# Altium schematic sheet 新风驱动板Nedic.SchDoc
size A2
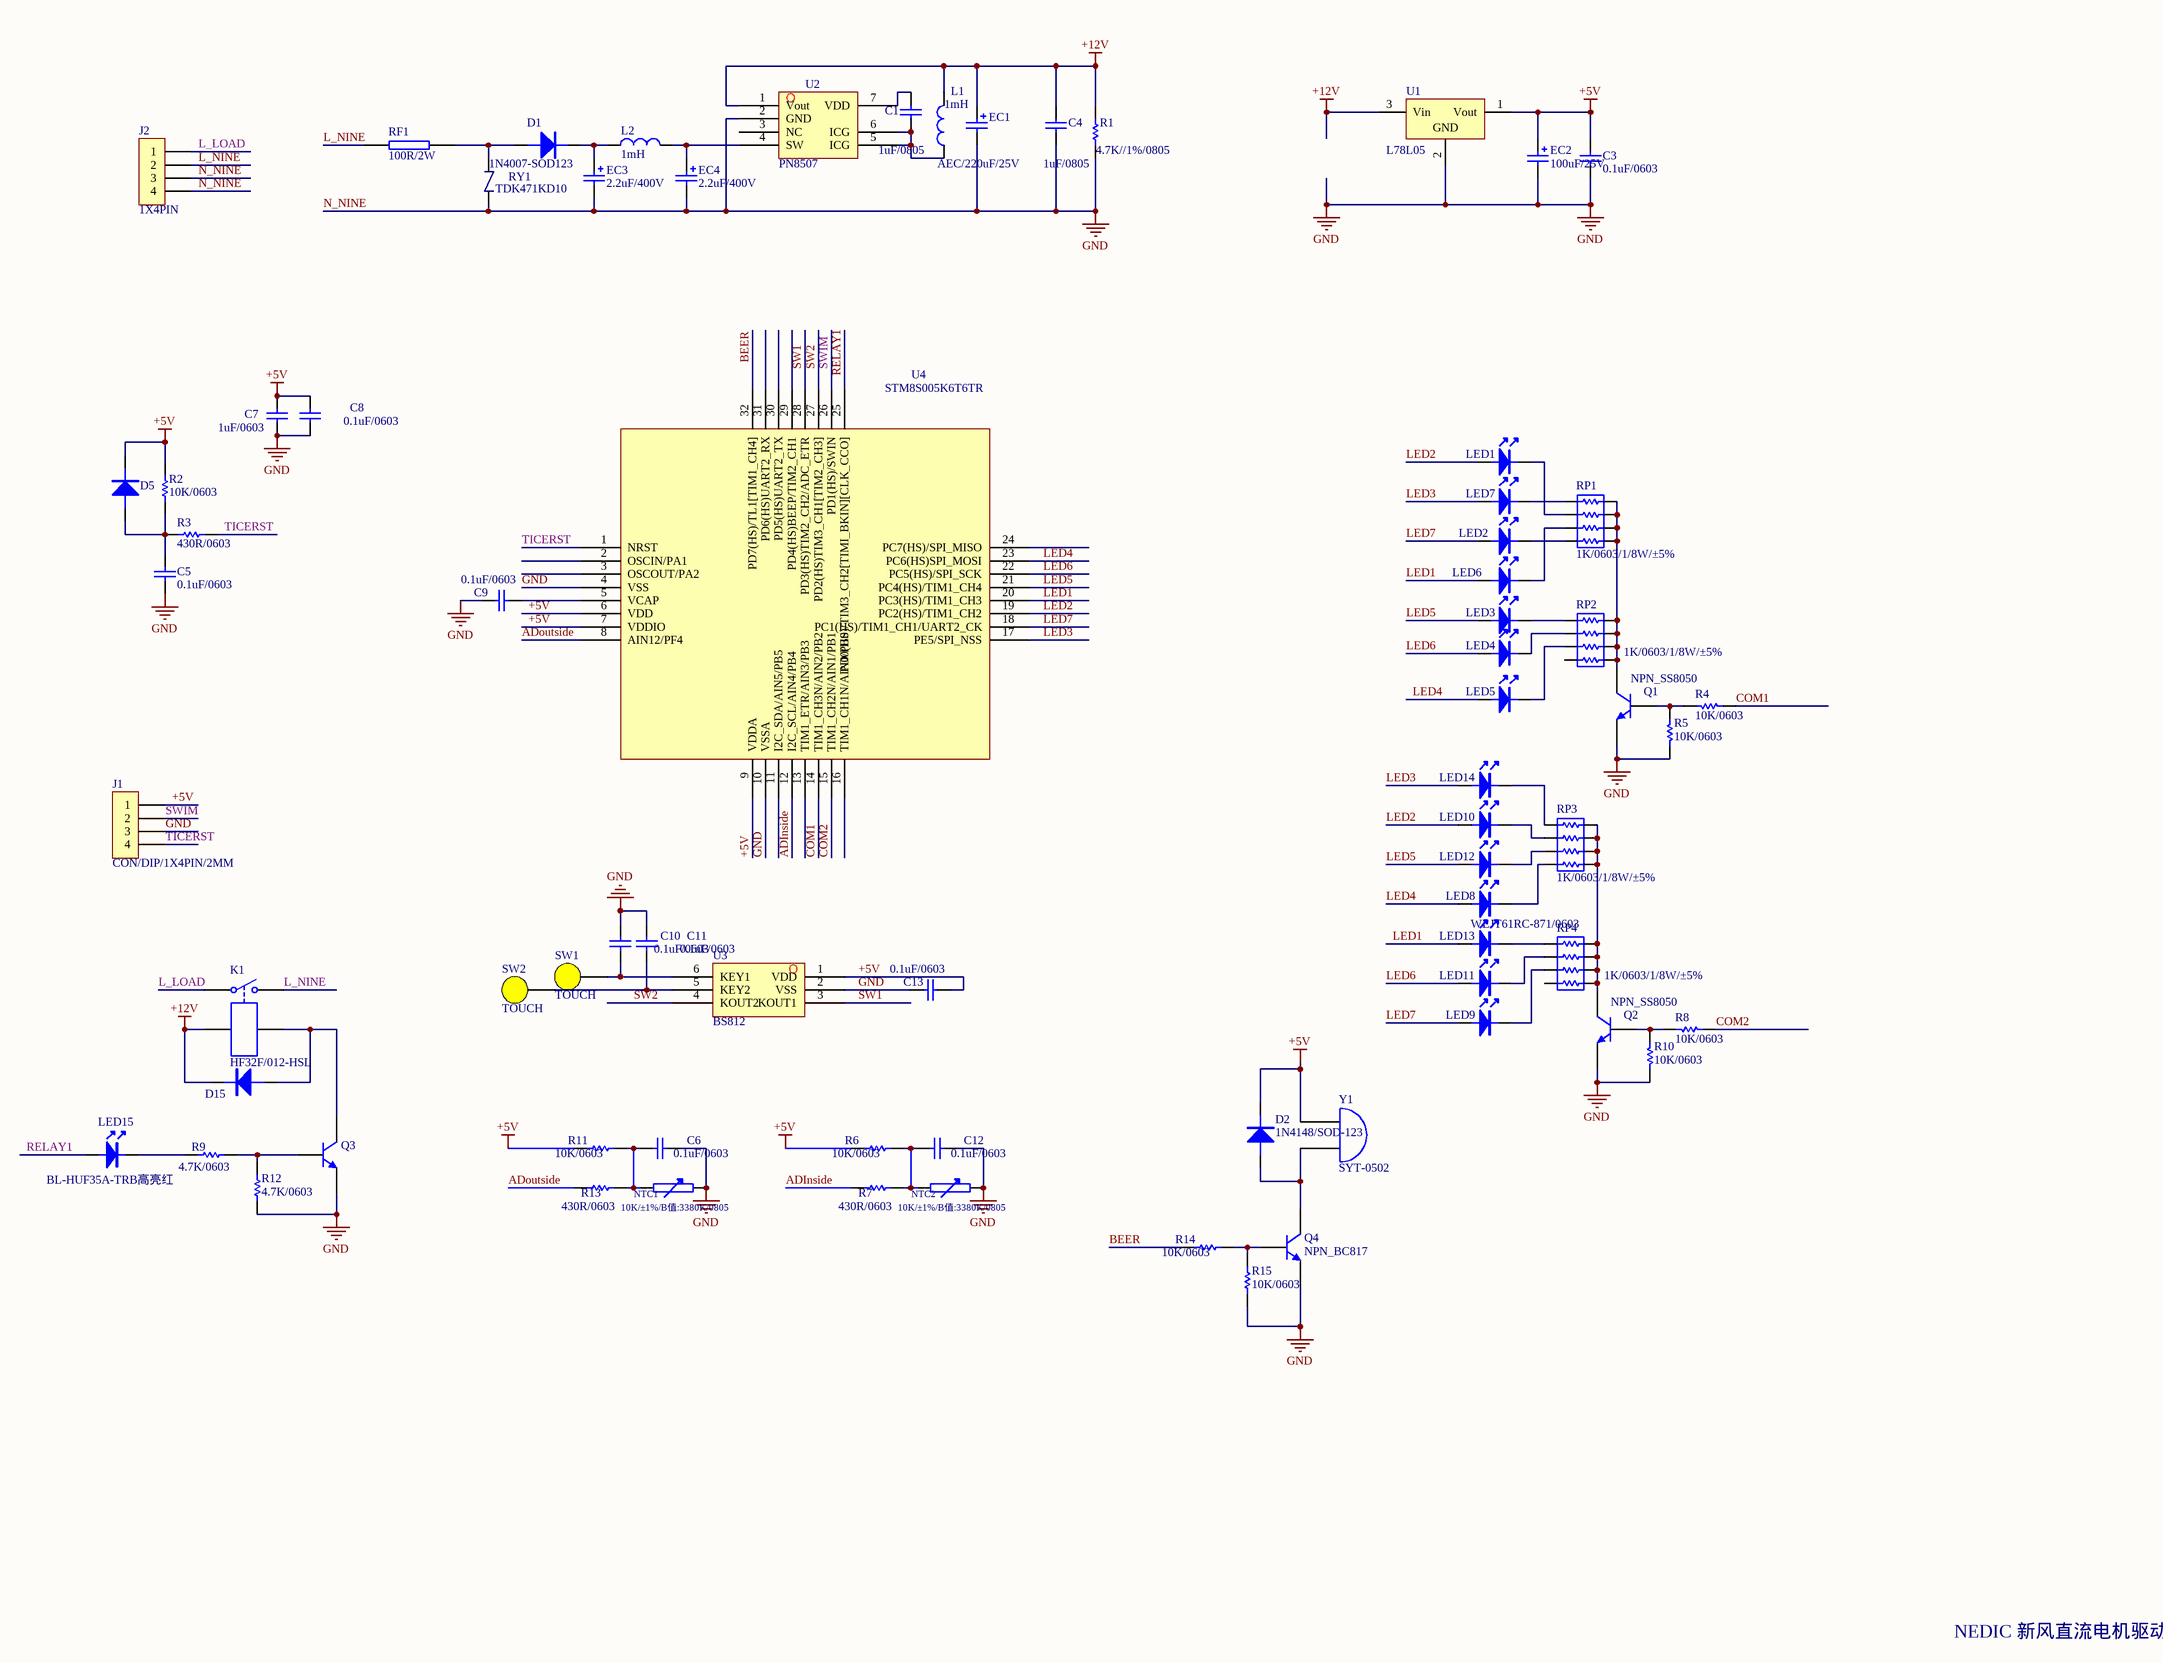
[diagram p0: 新风驱动板Nedic.SchDoc]

## Parts
C1  1uF/0805  [CAP/SMT/0805C]
C3  0.1uF/0603  [CAP/SMT/0603C]
C4  1uF/0805  [CAP/SMT/0805C]
C5  0.1uF/0603  [CAP/SMT/0603C]
C6  0.1uF/0603  [CAP/SMT/0603C]
C7  1uF/0603  [CAP/SMT/0603C]
C8  0.1uF/0603  [CAP/SMT/0603C]
C9  0.1uF/0603  [CAP/SMT/0603C]
C10  0.1uF/0603  [CAP/SMT/0603C]
C11  0.1uF/0603  [CAP/SMT/0603C]
C12  0.1uF/0603  [CAP/SMT/0603C]
C13  0.1uF/0603  [CAP/SMT/0603C]
D1  1N4007-SOD123  [D/SMT/SOD123]
D2  1N4148/SOD-123  [D/SMT/SOD-123]
D5  1N4148/SOD-123  [D/SMT/SOD-123]  (value not drawn)
D15  1N4148/SOD-123  [D/SMT/SOD-123]  (value not drawn)
EC1  AEC/220uF/25V  [CAP/DIP/330UF/25V]
EC2  100uF/25V  [CAP/DIP/100uF/25V]
EC3  2.2uF/400V  [CAP/DIP/2.2UF/400V/2.5mm]
EC4  2.2uF/400V  [CAP/DIP/2.2UF/400V/2.5mm]
J1  CON/DIP/1X4PIN/2MM  [CON/DIP/1×4PIN/2.0MM]
J2  1X4PIN  [CON/DIP/1×4PIN/5.08MM]
K1  HF32F/012-HSL  [RELAY/HF32F-012-HSL]
L1  1mH  [L/DIP/1mH]
L2  1mH  [L/DIP/1mH]
LED1  WEJT61RC-871/0603  [D/SMT/LED/0603]  (value not drawn)
LED2  WEJT61RC-871/0603  [D/SMT/LED/0603]  (value not drawn)
LED3  WEJT61RC-871/0603  [D/SMT/LED/0603]  (value not drawn)
LED4  WEJT61RC-871/0603  [D/SMT/LED/0603]  (value not drawn)
LED5  WEJT61RC-871/0603  [D/SMT/LED/0603]  (value not drawn)
LED6  WEJT61RC-871/0603  [D/SMT/LED/0603]  (value not drawn)
LED7  WEJT61RC-871/0603  [D/SMT/LED/0603]  (value not drawn)
LED8  WEJT61RC-871/0603  [D/SMT/LED/0603]
LED9  WEJT61RC-871/0603  [D/SMT/LED/0603]  (value not drawn)
LED10  WEJT61RC-871/0603  [D/SMT/LED/0603]  (value not drawn)
LED11  WEJT61RC-871/0603  [D/SMT/LED/0603]  (value not drawn)
LED12  WEJT61RC-871/0603  [D/SMT/LED/0603]  (value not drawn)
LED13  WEJT61RC-871/0603  [D/SMT/LED/0603]  (value not drawn)
LED14  WEJT61RC-871/0603  [D/SMT/LED/0603]  (value not drawn)
LED15  BL-HUF35A-TRB高亮红  [D/SMT/LED/0805]
NTC1  10K/±1%/B值:3380K/0805  [Sensor/S_NTC_DIP]
NTC2  10K/±1%/B值:3380K/0805  [CON/DIP/1×2PIN/2.54MM/插件端子]
Q1  NPN_SS8050  [BJT/SMT/SOT-23]
Q2  NPN_SS8050  [BJT/SMT/SOT-23]
Q3  NPN_SS8050  [BJT/SMT/SOT-23]  (value not drawn)
Q4  NPN_BC817  [BJT/SMT/SOT-23]
R1  4.7K//1%/0805  [0805R]
R2  10K/0603  [0603R]
R3  430R/0603  [0603R]
R4  10K/0603  [0603R]
R5  10K/0603  [0603R]
R6  10K/0603  [0603R]
R7  430R/0603  [0603R]
R8  10K/0603  [0603R]
R9  4.7K/0603  [0603R]
R10  10K/0603  [0603R]
R11  10K/0603  [0603R]
R12  4.7K/0603  [0603R]
R13  430R/0603  [0603R]
R14  10K/0603  [0603R]
R15  10K/0603  [0603R]
RF1  100R/2W  [FUSE/3.15A]
RP1  1K/0603/1/8W/±5%  [0603R*4]
RP2  1K/0603/1/8W/±5%  [0603R*4]
RP3  1K/0603/1/8W/±5%  [0603R*4]
RP4  1K/0603/1/8W/±5%  [0603R*4]
RY1  TDK471KD10  [RES/RY/TDK471KD10]
SW1  TOUCH  [SWITCH/TOUCH-2]
SW2  TOUCH  [SWITCH/TOUCH-2]
U1  L78L05  [SOT-89-3L(78L05)]
U2  PN8507  [SOP-7]
U3  BS812  [SOT23-6]
U4  STM8S005K6T6TR  [LQFP32]
Y1  SYT-0502  [SYT-5020]

## Nets
+5V: C3.2 C7.2 C8.2 C13.1 D2.1(K) D5.1(K) EC2.1 J1.1 R2.1 R6.2 R11.2 U1.1(Vout) U3.1(VDD) U4.6(VDD) U4.7(VDDIO) U4.9(VDDA) Y1.1
+12V: C4.2 D15.1(K) EC1.1 K1.3 L1.2 R1.2 U1.3(Vin) U2.1(Vout)
GND: C3.1 C4.1 C5.2 C6.1 C7.1 C8.1 C9.2 C10.2 C11.2 C12.1 C13.2 EC1.2 EC2.2 EC3.2 EC4.2 J1.3 J2.3 J2.4 NTC1.2 NTC2.2 Q1.2(E) Q2.2(E) Q3.2(E) Q4.2(E) R1.1 R5.2 R10.2 R12.2 R15.2 RY1.1 U1.2(GND) U2.2(GND) U3.2(VSS) U4.4(VSS) U4.10(VSSA)  [also labelled N_NINE]
ADInside: R7.2 U4.12(I2C_SCL/AIN4/PB4)
ADoutside: R13.2 U4.8(AIN12/PF4)
BEER: R14.2 U4.32(PD7(HS)/TL1[TIM1_CH4])
COM1: R4.1 U4.14(TIM1_CH3N/AIN2/PB2)
COM2: R8.1 U4.15(TIM1_CH2N/AIN1/PB1)
L_LOAD: J2.1 K1.1
L_NINE: J2.2 K1.2 RF1.2
LED1: LED6.2(A) LED13.2(A) U4.20(PC3(HS)/TIM1_CH3)
LED2: LED1.2(A) LED10.2(A) U4.19(PC2(HS)/TIM1_CH2)
LED3: LED7.2(A) LED14.2(A) U4.17(PE5/SPI_NSS)
LED4: LED5.2(A) LED8.2(A) U4.23(PC6(HS)SPI_MOSI)
LED5: LED3.2(A) LED12.2(A) U4.21(PC4(HS)/TIM1_CH4)
LED6: LED4.2(A) LED11.2(A) U4.22(PC5(HS)/SPI_SCK)
LED7: LED2.2(A) LED9.2(A) U4.18(PC1(HS)/TIM1_CH1/UART2_CK)
RELAY1: LED15.2(A) U4.25(PD0(HS)/TIM3_CH2[TIMI_BKIN][CLK_CCO])
SW1: U3.3(KOUT1) U4.28(PD3(HS)TIM2_CH2/ADC_ETR)
SW2: U3.4(KOUT2) U4.27(PD2(HS)TIM3_CH1[TIM2_CH3])
SWIM: J1.2 U4.26(PD1(HS)/SWIN)
TICERST: J1.4 R3.2 U4.1(NRST)
NetC1_1: C1.1 L1.1 U2.5(ICG) U2.6(ICG)
NetC1_2: C1.2 U2.7(VDD)
NetC5_1: C5.1 D5.2(A) R2.2 R3.1
NetC6_2: C6.2 NTC1.1 R11.1 R13.1
NetC9_1: C9.1 U4.5(VCAP)
NetC10_1: C10.1 SW1.1 U3.6(KEY1)
NetC11_1: C11.1 SW2.1 U3.5(KEY2)
NetC12_2: C12.2 NTC2.1 R6.1 R7.1
NetD1_1: D1.1(K) EC3.1 L2.1
NetD1_2: D1.2(A) RF1.1 RY1.2
NetD2_2: D2.2(A) Q4.3(C) Y1.2
NetD15_2: D15.2(A) K1.4 Q3.3(C)
NetEC4_1: EC4.1 L2.2 U2.4(SW)
NetLED1_1: LED1.1(K) RP1.6
NetLED2_1: LED2.1(K) RP1.8
NetLED3_1: LED3.1(K) RP2.5
NetLED4_1: LED4.1(K) RP2.6
NetLED5_1: LED5.1(K) RP2.7
NetLED6_1: LED6.1(K) RP1.7
NetLED7_1: LED7.1(K) RP1.5
NetLED8_1: LED8.1(K) RP3.8
NetLED9_1: LED9.1(K) RP4.7
NetLED10_1: LED10.1(K) RP3.6
NetLED11_1: LED11.1(K) RP4.6
NetLED12_1: LED12.1(K) RP3.7
NetLED13_1: LED13.1(K) RP4.5
NetLED14_1: LED14.1(K) RP3.5
NetLED15_1: LED15.1(K) R9.2
NetQ1_1: Q1.1(B) R4.2 R5.1
NetQ1_3: Q1.3(C) RP1.1 RP1.2 RP1.3 RP1.4 RP2.1 RP2.2 RP2.3 RP2.4
NetQ2_1: Q2.1(B) R8.2 R10.1
NetQ2_3: Q2.3(C) RP3.1 RP3.2 RP3.3 RP3.4 RP4.1 RP4.2 RP4.3 RP4.4
NetQ3_1: Q3.1(B) R9.1 R12.1
NetQ4_1: Q4.1(B) R14.1 R15.1

Not connected (* = marked no-connect by the designer): RP2 8; RP4 8; U2 3(NC); U4 2(OSCIN/PA1) 3(OSCOUT/PA2) 11(I2C_SDA/AIN5/PB5) 13(TIM1_ETR/AIN3/PB3) 16(TIM1_CH1N/AIN0/PB0) 24(PC7(HS)/SPI_MISO) 29(PD4(HS)BEEP/TIM2_CH1) 30(PD5(HS)UART2_TX) 31(PD6(HS)UART2_RX); Y1 3

## Notes on the sheet
- NEDIC 新风直流电机驱动板原理图

## Library data of the parts
C1 C4 = CAP/CAP/SMT/0805C
C3 C5-C13 = CAP/CAP/SMT/0603C
D1 = D/D/SMT/1N4007-SOD123
D2 D5 D15 = D/D/SMT/1N4148/SOD-123: VR=75V T(-65-175)P(0.5W)VF=0.6V
EC1 = CAP/AEC/DIP/330uF/25V
EC2 = CAP/AEC/DIP/100uF/25V
EC3 EC4 = CAP/AEC/DIP/2.2uF/400V
J1 = CON/DIP/1X4PIN/2MM: Connector
J2 = CON/DIP/1X4PIN/5.08MM: Connector
K1 = RELAY/GENERAL/DIP/HF32F/012-HSL
L1 L2 = L/L/DIP/JYGX68-1.0mH/300mA: 工字电感
LED1-LED14 = D/LED/SMT/WEJT61RC-871/0603
LED15 = D/LED/SMT/BL-HUF35A-TRB高亮红/0805
NTC1 NTC2 = SENSOR/NTC_SMD: 3380(10K); value: *
Q1 Q2 = BJT/NPN/SMT/SS8050/SOT-23: Vce25V/Vcb40V/Veb5V/Ic1.5V/Pd300mW; Published: *; Publisher: *; Manufacturer: *; Class: *; SubClass: *
Q3 = BJT/NPN/SMT/SS8050/SOT-23: Published: *; Publisher: *; Manufacturer: *; Class: *; SubClass: *
Q4 = BJT/NPN/SMT/BC817/SOT-23: Published: *; Publisher: *; Manufacturer: *; Class: *; SubClass: *
R1 = RES/RES/SMT/0805
R2-R15 = RES/RES/SMT/0603
RF1 = FUSE/FUSE/DIP/3.15A
RP1-RP4 = RES /PACKS/SMT/0603*4: Isolated Resistor Network; Value: 1K; Published: 24-Mar-1999; LatestRevisionDate: 29-May-2009; LatestRevisionNote: IPC-7351 Footprint Added.; PackageReference: SO-16; Publisher: Altium Limited; PackageDescription: 16-Pin Small Outline Integrated Circuit 1.27 mm Pitch; Code_JEDEC: MS-012-AC; Code_IPC: SOIC127P600-16
RY1 = RES/RY/DIP/TDK471KD10
SW1 SW2 = SWITCH/TOUCH
U1 = IC/POWER/SMT/L78L05/SOT-89: 5V三端稳压器 output imax 0.1A; Manufacturer: Generic Components; Class: Power Management; SubClass: Voltage Regulator; Published: 1999
U2 = IC/POWER/SMT/PN8507/SOP-8
U3 = IC/POWER/SMT/BS812
U4 = MCU/SMT/STM8S005K6T6TR/LQFP32
Y1 = OTHER/BEER/SYT-0502